# Altium schematic sheet Snippet_ISO7221+ULN2003.SchDoc
size 1188 x 840 mm
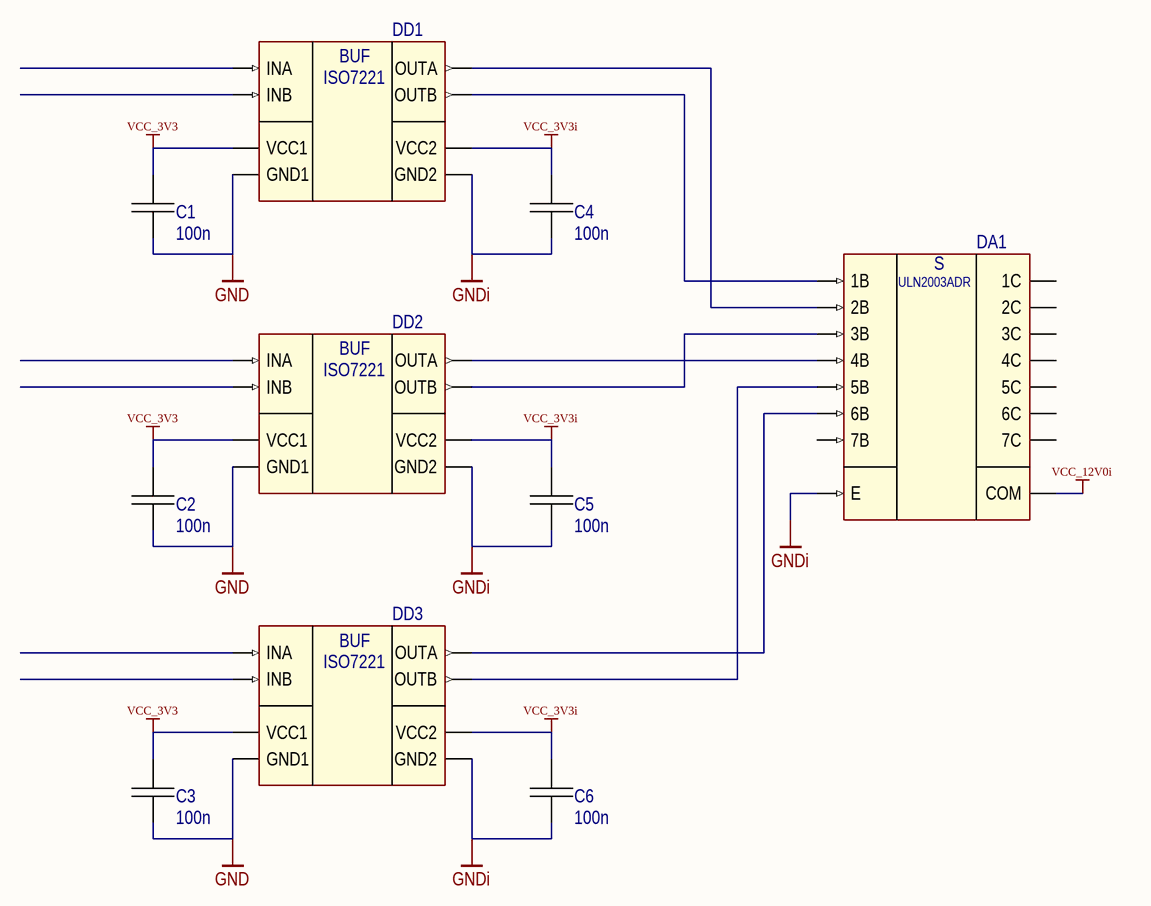
[diagram p0: Snippet_ISO7221+ULN2003.SchDoc]

## Parts
C1  100n  [Capacitor_0805]
C2  100n  [Capacitor_0805]
C3  100n  [Capacitor_0805]
C4  100n  [Capacitor_0805]
C5  100n  [Capacitor_0805]
C6  100n  [Capacitor_0805]
DA1  ULN2003  [MCP3208_SOIC16]  (value not drawn)
DD1  ISO7221  [ISO7221]  (value not drawn)
DD2  ISO7221  [ISO7221]  (value not drawn)
DD3  ISO7221  [ISO7221]  (value not drawn)

## Nets
GND: C1.2 C2.2 C3.2 DD1.4(GND1) DD2.4(GND1) DD3.4(GND1)
GNDi: C4.2 C5.2 C6.2 DA1.8(E) DD1.5(GND2) DD2.5(GND2) DD3.5(GND2)
VCC_3V3: C1.1 C2.1 C3.1 DD1.1(VCC1) DD2.1(VCC1) DD3.1(VCC1)
VCC_3V3i: C4.1 C5.1 C6.1 DD1.8(VCC2) DD2.8(VCC2) DD3.8(VCC2)
VCC_12V0i: DA1.9(COM)
NetDA1_1: DA1.1(1B) DD1.6(OUTB)
NetDA1_2: DA1.2(2B) DD1.2(OUTA)
NetDA1_3: DA1.3(3B) DD2.6(OUTB)
NetDA1_4: DA1.4(4B) DD2.2(OUTA)
NetDA1_5: DA1.5(5B) DD3.6(OUTB)
NetDA1_6: DA1.6(6B) DD3.2(OUTA)

Not connected (* = marked no-connect by the designer): DA1 7(7B) 10(7C) 11(6C) 12(5C) 13(4C) 14(3C) 15(2C) 16(1C); DD1 3(INB) 7(INA); DD2 3(INB) 7(INA); DD3 3(INB) 7(INA)

## Notes on the sheet
- (in symbol ISO7221) BUF
- (in symbol ULN2003) S; ULN2003ADR

## Library data of the parts
C1-C6 = Capacitor_0805